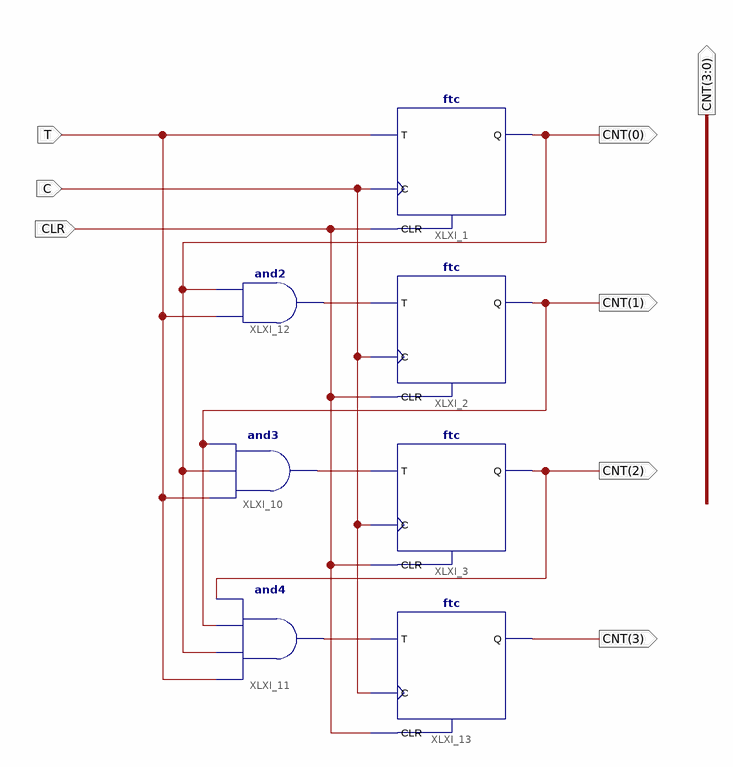
[diagram p0: schematic sheet 1]
// Xilinx ISE schematic lab7_3_CNT.sch (spartan3) as structural Verilog: 7 symbols, 8 ports
module lab7_3_CNT (
  input  C,
  input  T,
  input  CLR,
  output [3:0] CNT
);

  wire XLXN_4, XLXN_5, XLXN_7;

  ftc XLXI_1 (.C(C), .CLR(CLR), .T(T), .Q(CNT[0]));
  ftc XLXI_2 (.C(C), .CLR(CLR), .T(XLXN_7), .Q(CNT[1]));
  ftc XLXI_3 (.C(C), .CLR(CLR), .T(XLXN_4), .Q(CNT[2]));
  and XLXI_10 (XLXN_4, T, CNT[0], CNT[1]);
  and XLXI_11 (XLXN_5, T, CNT[0], CNT[1], CNT[2]);
  and XLXI_12 (XLXN_7, T, CNT[0]);
  ftc XLXI_13 (.C(C), .CLR(CLR), .T(XLXN_5), .Q(CNT[3]));
endmodule
